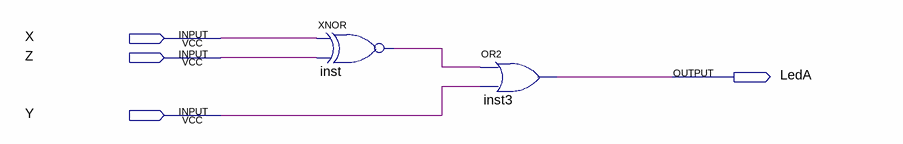
[diagram p0: schematic sheet]
// Quartus schematic LEDa.bdf as structural Verilog: 2 symbols, 4 pins
module LEDa (
  input  X,
  input  Z,
  input  Y,
  output LedA
);

  wire inst_out;

  xnor inst (inst_out, X, Z);
  or inst3 (LedA, inst_out, Y);
endmodule
